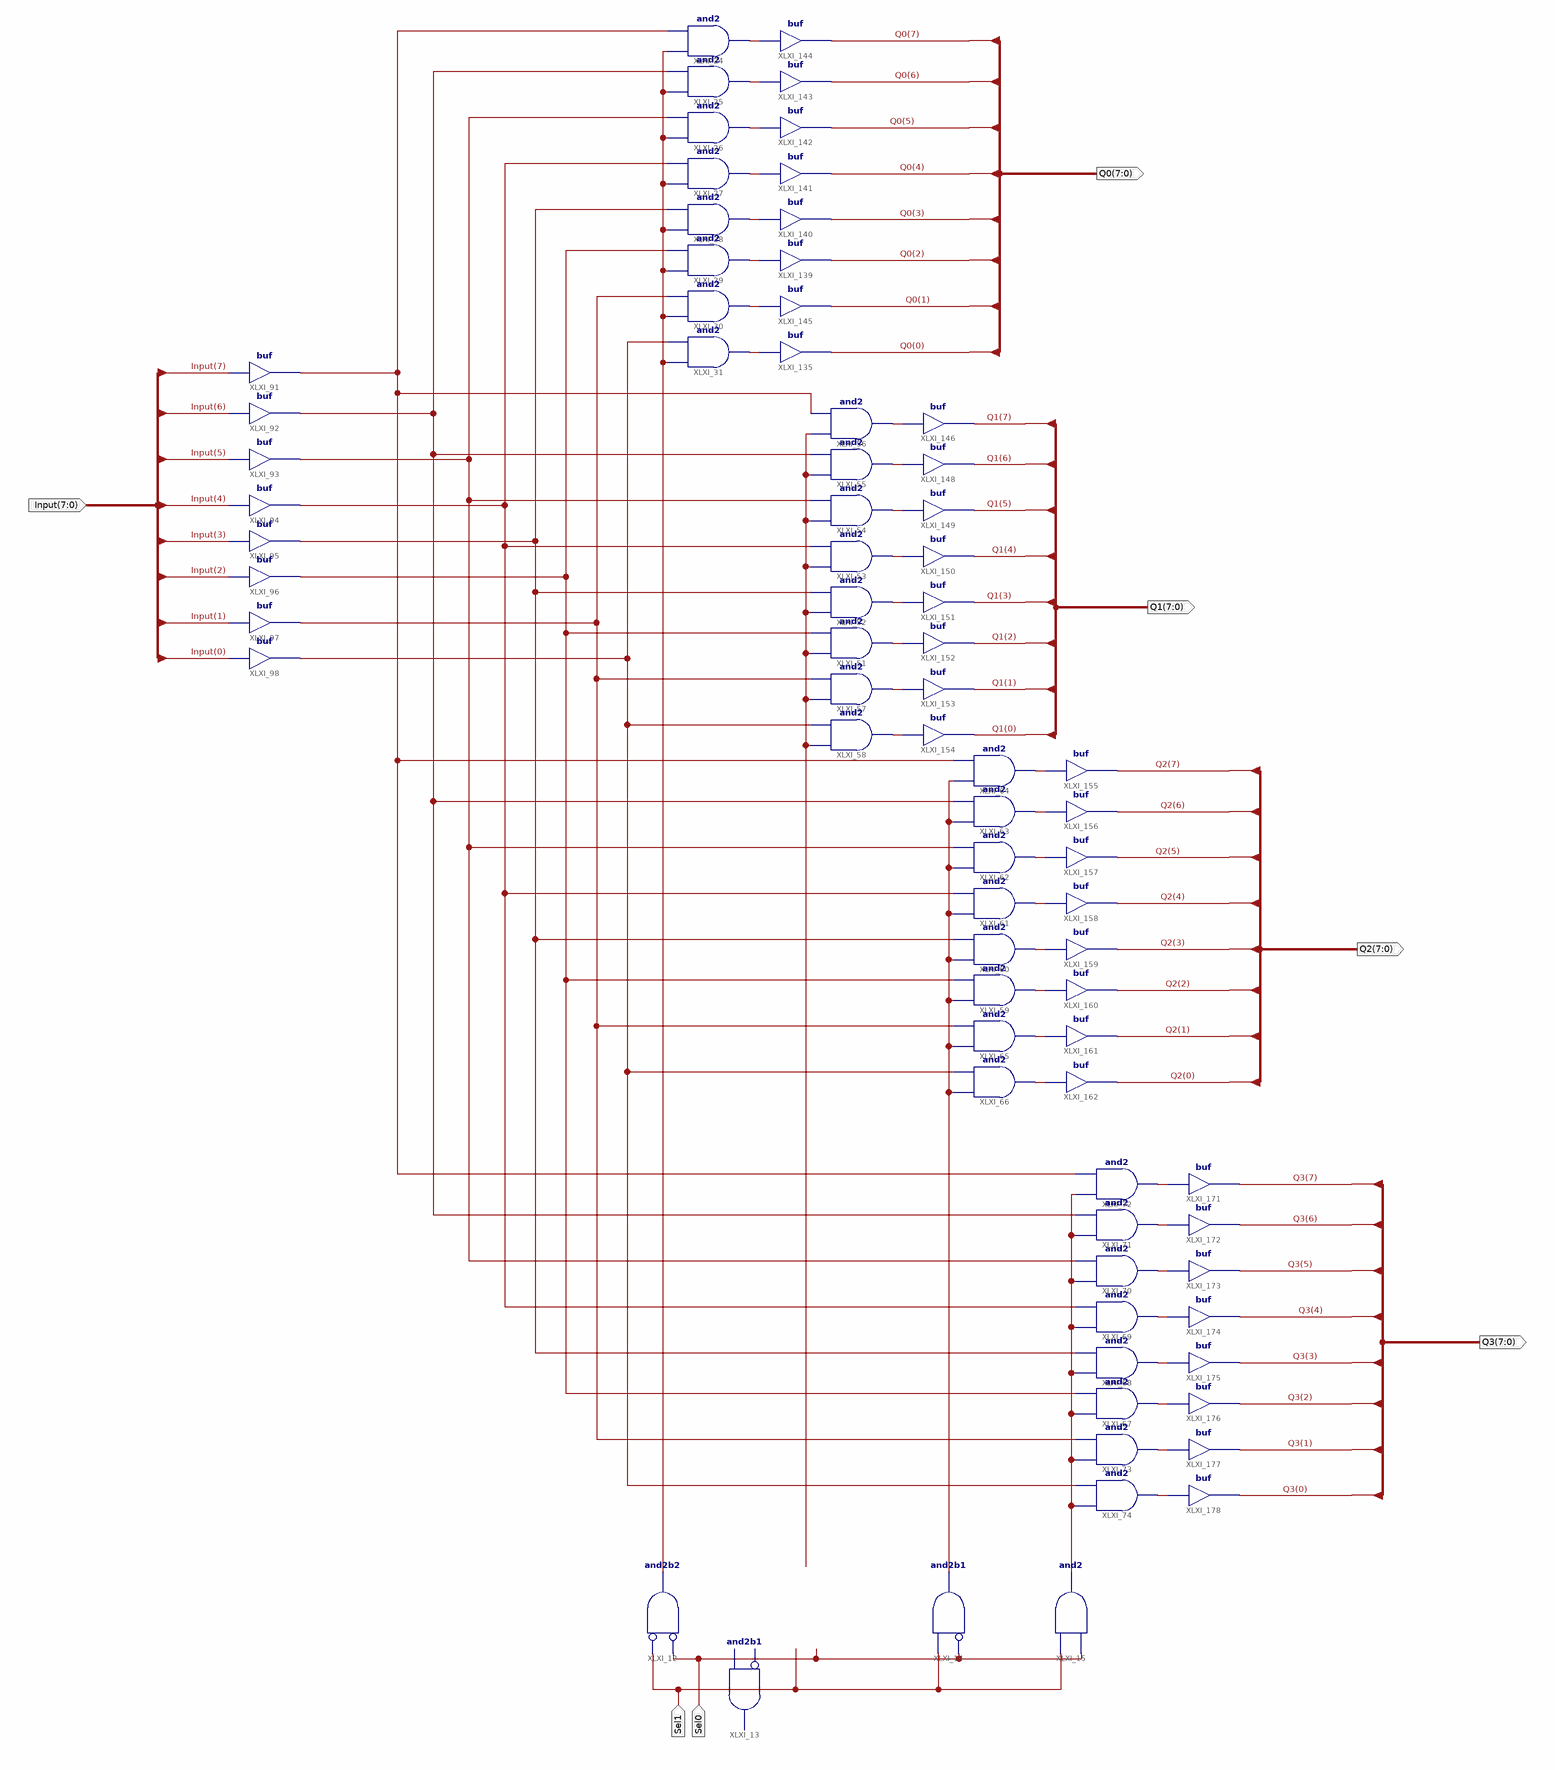
[diagram p0: schematic sheet 1]
// Xilinx ISE schematic deMUX1_4_8.sch (spartan6) as structural Verilog: 76 symbols, 7 ports
module deMUX1_4_8 (
  input  [7:0] Input,
  input  Sel1,
  input  Sel0,
  output [7:0] Q0,
  output [7:0] Q2,
  output [7:0] Q1,
  output [7:0] Q3
);

  wire XLXN_39, XLXN_48, XLXN_55, XLXN_67, XLXN_87, XLXN_96, XLXN_97, XLXN_100, XLXN_101, XLXN_102, XLXN_104,
       XLXN_114, XLXN_120, XLXN_122, XLXN_123, XLXN_124, XLXN_125, XLXN_126, XLXN_127, XLXN_128, XLXN_129,
       XLXN_130, XLXN_131, XLXN_132, XLXN_133, XLXN_134, XLXN_135, XLXN_136, XLXN_137, XLXN_138, XLXN_139,
       XLXN_140, XLXN_141, XLXN_142, XLXN_143, XLXN_144, XLXN_153, XLXN_154, XLXN_155, XLXN_156, XLXN_157,
       XLXN_158, XLXN_159, XLXN_160;

  buf XLXI_91 (XLXN_87, Input[7]);
  buf XLXI_92 (XLXN_96, Input[6]);
  buf XLXI_93 (XLXN_97, Input[5]);
  buf XLXI_94 (XLXN_100, Input[4]);
  buf XLXI_95 (XLXN_101, Input[3]);
  buf XLXI_96 (XLXN_102, Input[2]);
  buf XLXI_97 (XLXN_114, Input[1]);
  buf XLXI_98 (XLXN_104, Input[0]);
  and XLXI_29 (XLXN_122, XLXN_39, XLXN_102);
  and XLXI_28 (XLXN_123, XLXN_39, XLXN_101);
  and XLXI_27 (XLXN_124, XLXN_39, XLXN_100);
  and XLXI_26 (XLXN_125, XLXN_39, XLXN_97);
  and XLXI_25 (XLXN_126, XLXN_39, XLXN_96);
  and XLXI_24 (XLXN_127, XLXN_39, XLXN_87);
  and XLXI_30 (XLXN_128, XLXN_39, XLXN_114);
  and XLXI_31 (XLXN_120, XLXN_39, XLXN_104);
  and XLXI_51 (XLXN_134, XLXN_48, XLXN_102);
  and XLXI_52 (XLXN_133, XLXN_48, XLXN_101);
  and XLXI_53 (XLXN_132, XLXN_48, XLXN_100);
  and XLXI_54 (XLXN_131, XLXN_48, XLXN_97);
  and XLXI_55 (XLXN_130, XLXN_48, XLXN_96);
  and XLXI_56 (XLXN_129, XLXN_48, XLXN_87);
  and XLXI_57 (XLXN_135, XLXN_48, XLXN_114);
  and XLXI_58 (XLXN_136, XLXN_48, XLXN_104);
  and XLXI_59 (XLXN_142, XLXN_55, XLXN_102);
  and XLXI_60 (XLXN_141, XLXN_55, XLXN_101);
  and XLXI_61 (XLXN_140, XLXN_55, XLXN_100);
  and XLXI_62 (XLXN_139, XLXN_55, XLXN_97);
  and XLXI_63 (XLXN_138, XLXN_55, XLXN_96);
  and XLXI_64 (XLXN_137, XLXN_55, XLXN_87);
  and XLXI_65 (XLXN_143, XLXN_55, XLXN_114);
  and XLXI_66 (XLXN_144, XLXN_55, XLXN_104);
  and XLXI_67 (XLXN_158, XLXN_67, XLXN_102);
  and XLXI_68 (XLXN_157, XLXN_67, XLXN_101);
  and XLXI_69 (XLXN_156, XLXN_67, XLXN_100);
  and XLXI_70 (XLXN_155, XLXN_67, XLXN_97);
  and XLXI_71 (XLXN_154, XLXN_67, XLXN_96);
  and XLXI_72 (XLXN_153, XLXN_67, XLXN_87);
  and XLXI_73 (XLXN_159, XLXN_67, XLXN_114);
  and XLXI_74 (XLXN_160, XLXN_67, XLXN_104);
  and XLXI_12 (XLXN_39, ~Sel0, ~Sel1);  // and2b2
  and XLXI_14 (XLXN_55, ~Sel0, Sel1);  // and2b1
  and XLXI_13 (XLXN_48, ~Sel1, Sel0);  // and2b1
  and XLXI_15 (XLXN_67, Sel0, Sel1);
  buf XLXI_135 (Q0[0], XLXN_120);
  buf XLXI_139 (Q0[2], XLXN_122);
  buf XLXI_140 (Q0[3], XLXN_123);
  buf XLXI_141 (Q0[4], XLXN_124);
  buf XLXI_142 (Q0[5], XLXN_125);
  buf XLXI_143 (Q0[6], XLXN_126);
  buf XLXI_144 (Q0[7], XLXN_127);
  buf XLXI_145 (Q0[1], XLXN_128);
  buf XLXI_146 (Q1[7], XLXN_129);
  buf XLXI_148 (Q1[6], XLXN_130);
  buf XLXI_149 (Q1[5], XLXN_131);
  buf XLXI_150 (Q1[4], XLXN_132);
  buf XLXI_151 (Q1[3], XLXN_133);
  buf XLXI_152 (Q1[2], XLXN_134);
  buf XLXI_153 (Q1[1], XLXN_135);
  buf XLXI_154 (Q1[0], XLXN_136);
  buf XLXI_155 (Q2[7], XLXN_137);
  buf XLXI_156 (Q2[6], XLXN_138);
  buf XLXI_157 (Q2[5], XLXN_139);
  buf XLXI_158 (Q2[4], XLXN_140);
  buf XLXI_159 (Q2[3], XLXN_141);
  buf XLXI_160 (Q2[2], XLXN_142);
  buf XLXI_161 (Q2[1], XLXN_143);
  buf XLXI_162 (Q2[0], XLXN_144);
  buf XLXI_171 (Q3[7], XLXN_153);
  buf XLXI_172 (Q3[6], XLXN_154);
  buf XLXI_173 (Q3[5], XLXN_155);
  buf XLXI_174 (Q3[4], XLXN_156);
  buf XLXI_175 (Q3[3], XLXN_157);
  buf XLXI_176 (Q3[2], XLXN_158);
  buf XLXI_177 (Q3[1], XLXN_159);
  buf XLXI_178 (Q3[0], XLXN_160);
endmodule
